# Altium project V5_BASE.PrjPcb
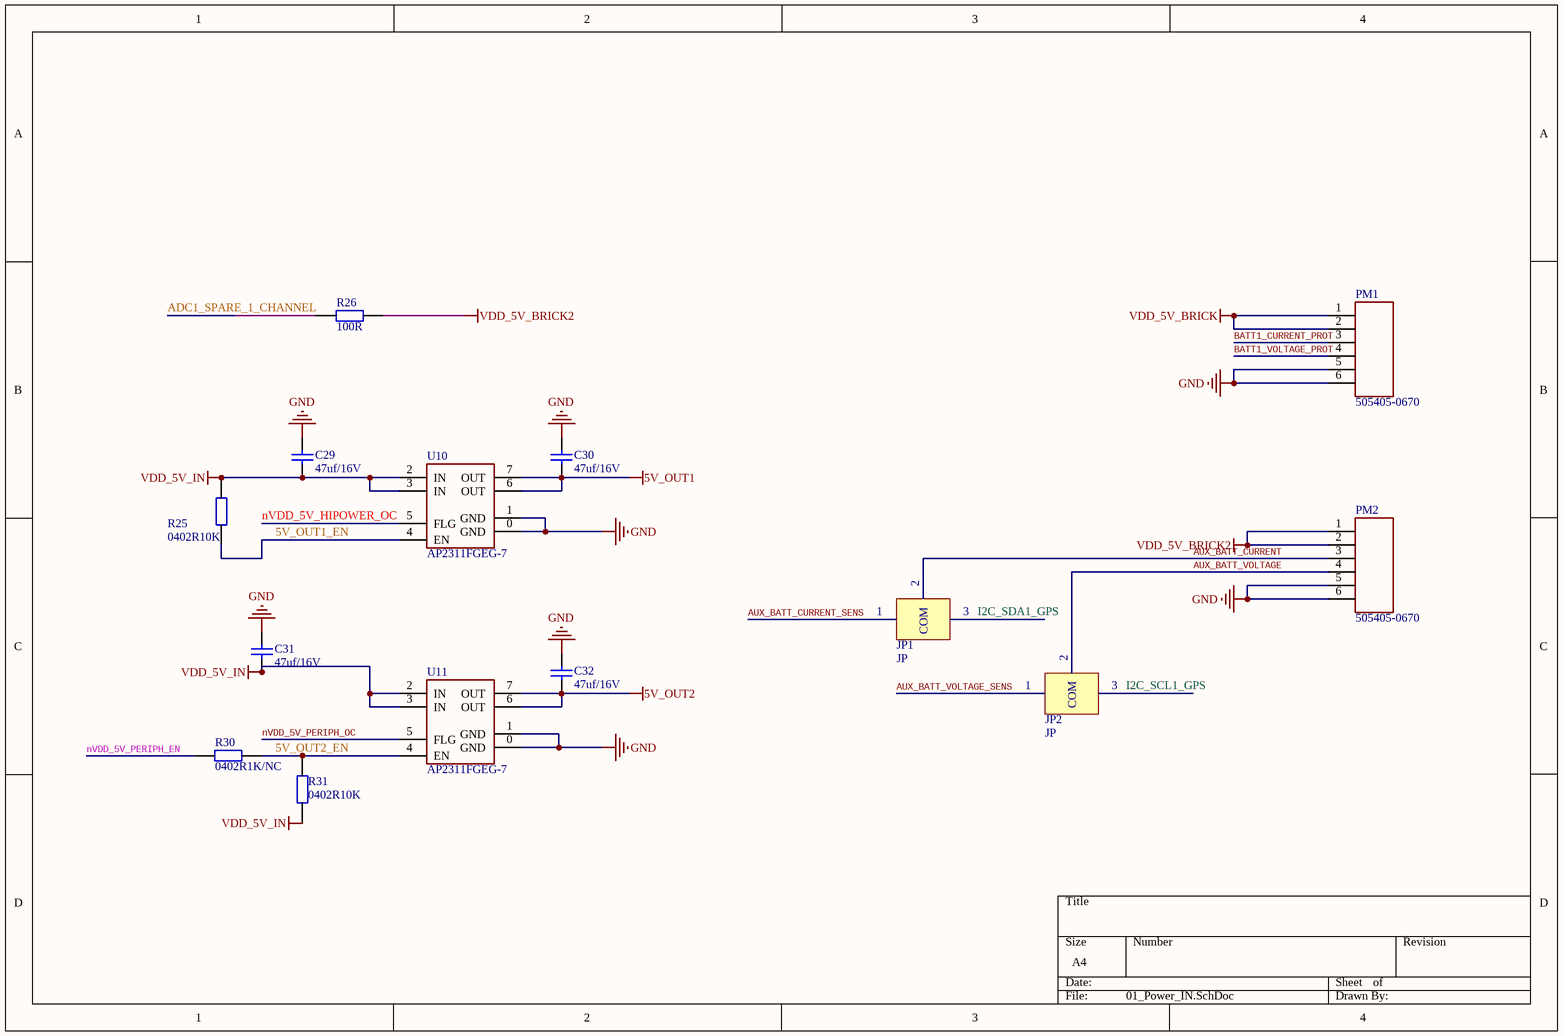
[diagram p0: 01_Power_IN.SchDoc]
5 sheets, 98 parts. Net scope: global (net labels, ports and power ports of the same name join across sheets).
Board file: V5_BASE_V17.PcbDoc
Sheets:
  01_Power_IN.SchDoc
  02_B_TO_B_CON.SchDoc
  03_Power_Switch.SchDoc
  04_POWER_LDO.SchDoc
  05_DATA_IO.SchDoc

## Sheet 01_Power_IN.SchDoc
size A4

### Parts
C29  47uf/16V  [0805CAP]
C30  47uf/16V  [0805CAP]
C31  47uf/16V  [0805CAP]
C32  47uf/16V  [0805CAP]
JP1  JP  [0402R-SR]
JP2  JP  [0402R-SR]
PM1  505405-0670  [5054050660]
PM2  505405-0670  [5054050660]
R25  0402R10K  [0402R]
R26  100R  [0402R]
R30  0402R1K/NC  [0402R]
R31  0402R10K  [0402R]
U10  AP2311FGEG-7  [QFN8_0.65]
U11  AP2311FGEG-7  [QFN8_0.65]

### Nets
5V_OUT1: C30.1 U10.6(OUT) U10.7(OUT)
5V_OUT2: C32.1 U11.6(OUT) U11.7(OUT)
GND: C29.2 C30.2 C31.2 C32.2 PM1.5 PM1.6 PM2.5 PM2.6 U10.0(GND) U10.1(GND) U11.0(GND) U11.1(GND)
VDD_5V_BRICK: PM1.1 PM1.2
VDD_5V_BRICK2: PM2.1 PM2.2 R26.2
VDD_5V_IN: C29.1 C31.1 R25.2 R31.2 U10.2(IN) U10.3(IN) U11.2(IN) U11.3(IN)
5V_OUT1_EN: R25.1 U10.4(EN)
5V_OUT2_EN: R30.1 R31.1 U11.4(EN)
ADC1_SPARE_1_CHANNEL: R26.1
AUX_BATT_CURRENT: JP1.2(COM) PM2.3
AUX_BATT_CURRENT_SENS: JP1.1
AUX_BATT_VOLTAGE: JP2.2(COM) PM2.4
AUX_BATT_VOLTAGE_SENS: JP2.1
BATT1_CURRENT_PROT: PM1.3
BATT1_VOLTAGE_PROT: PM1.4
I2C_SCL1_GPS: JP2.3
I2C_SDA1_GPS: JP1.3
nVDD_5V_HIPOWER_OC: U10.5(FLG)
nVDD_5V_PERIPH_EN: R30.2
nVDD_5V_PERIPH_OC: U11.5(FLG)

### Library data of the parts
C29-C32 = Cap: Capacitor
JP1 JP2 = 0402R-SR
PM1 PM2 = 5054050660
R25 R26 R30 R31 = 0402R1K: 0402R1K 1%

## Sheet 02_B_TO_B_CON.SchDoc
size A3
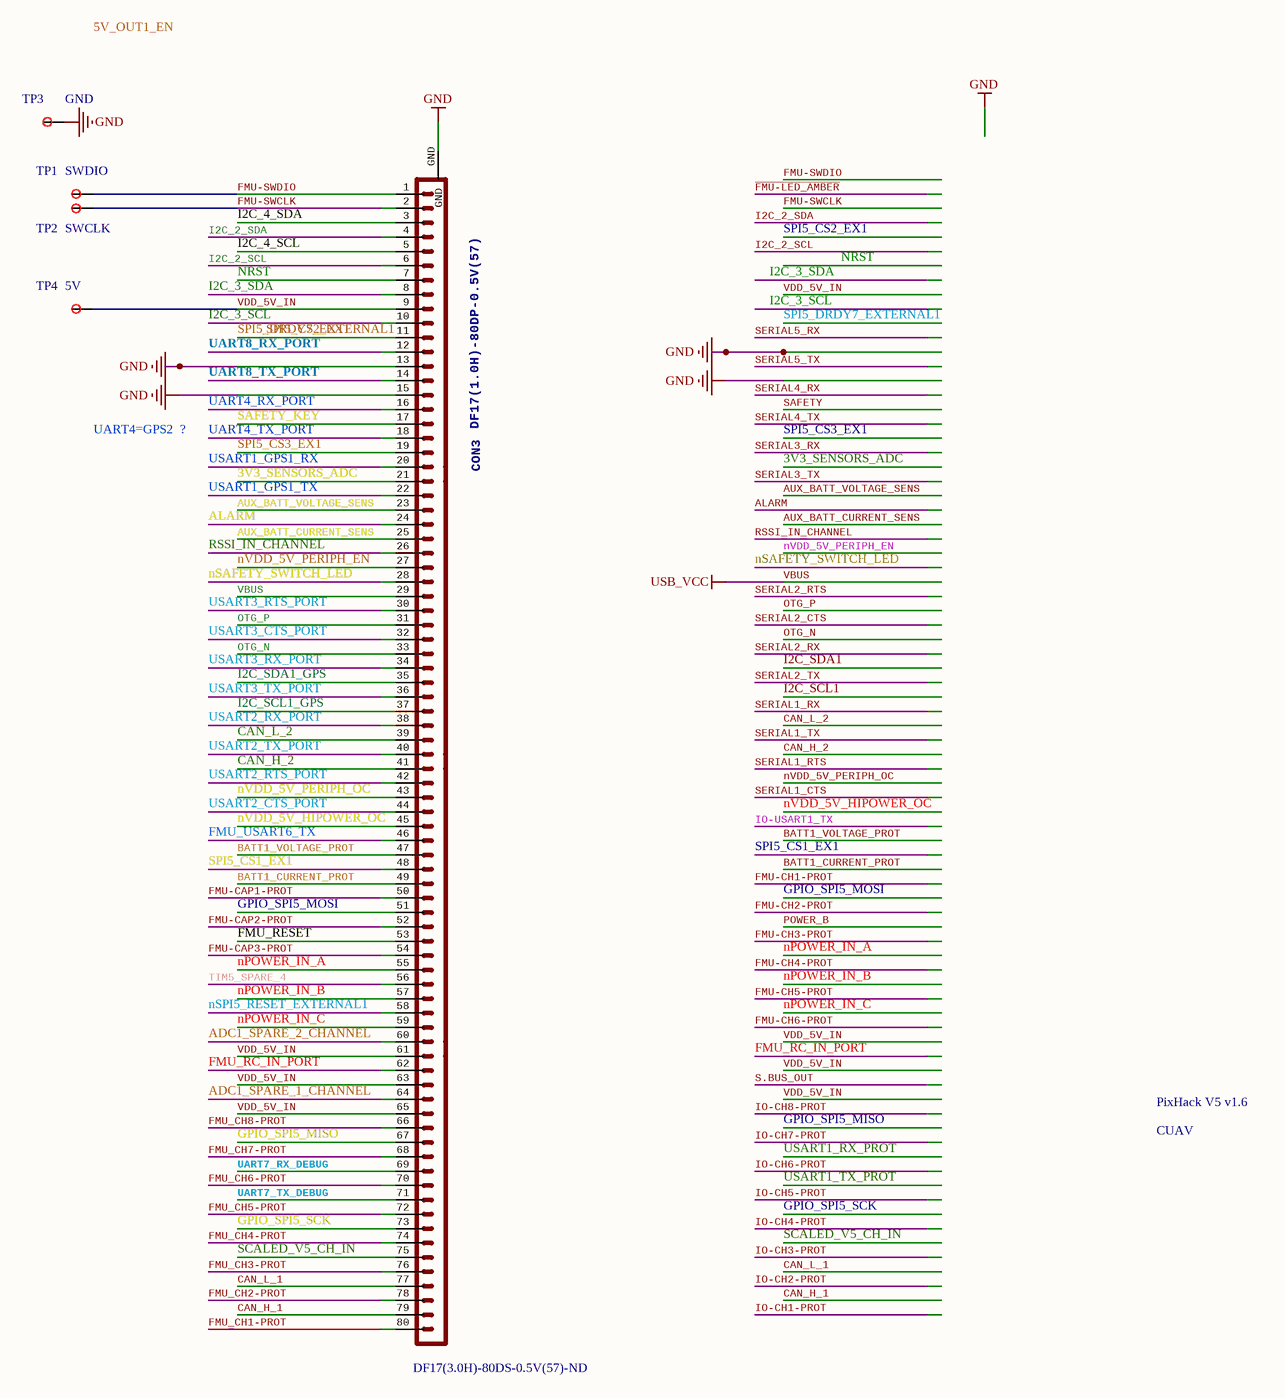
[diagram p1: 02_B_TO_B_CON.SchDoc]

### Parts
CON3  DF17(1.0H)-80DP-0.5V(57)  Supplier Part Number 1: DF17(3.0H)-80DS-0.5V(57)-ND  [DF17(1.0H)-80DP-0.5V(57)]
PixHack_V5_v1.6  CUAV  [CUAV]
TP1  SWDIO  [TP0.75]
TP2  SWCLK  [TP0.75]
TP3  GND  [TP0.75]
TP4  5V  [TP0.75]

### Nets
GND: CON3.13 CON3.15 CON3.GND TP3.0
VBUS: CON3.29  [also labelled USB_VCC]
VDD_5V_IN: CON3.9 CON3.61 CON3.63 CON3.65 TP4.0
3V3_SENSORS_ADC: CON3.21
ADC1_SPARE_1_CHANNEL: CON3.64
ADC1_SPARE_2_CHANNEL: CON3.60
ALARM: CON3.24
AUX_BATT_CURRENT_SENS: CON3.25
AUX_BATT_VOLTAGE_SENS: CON3.23
BATT1_CURRENT_PROT: CON3.49
BATT1_VOLTAGE_PROT: CON3.47
CAN_H_1: CON3.79
CAN_H_2: CON3.41
CAN_L_1: CON3.77
CAN_L_2: CON3.39
FMU-CAP1-PROT: CON3.50
FMU-CAP2-PROT: CON3.52
FMU-CAP3-PROT: CON3.54
FMU-SWCLK: CON3.2 TP2.0
FMU-SWDIO: CON3.1 TP1.0
FMU_CH1-PROT: CON3.80
FMU_CH2-PROT: CON3.78
FMU_CH3-PROT: CON3.76
FMU_CH4-PROT: CON3.74
FMU_CH5-PROT: CON3.72
FMU_CH6-PROT: CON3.70
FMU_CH7-PROT: CON3.68
FMU_CH8-PROT: CON3.66
FMU_RC_IN_PORT: CON3.62
FMU_RESET: CON3.53
FMU_USART6_TX: CON3.46
GPIO_SPI5_MISO: CON3.67
GPIO_SPI5_MOSI: CON3.51
GPIO_SPI5_SCK: CON3.73
I2C_2_SCL: CON3.6
I2C_2_SDA: CON3.4
I2C_3_SCL: CON3.10
I2C_3_SDA: CON3.8
I2C_4_SCL: CON3.5
I2C_4_SDA: CON3.3
I2C_SCL1_GPS: CON3.37
I2C_SDA1_GPS: CON3.35
nPOWER_IN_A: CON3.55
nPOWER_IN_B: CON3.57
nPOWER_IN_C: CON3.59
NRST: CON3.7
nSAFETY_SWITCH_LED: CON3.28
nSPI5_RESET_EXTERNAL1: CON3.58
nVDD_5V_HIPOWER_OC: CON3.45
nVDD_5V_PERIPH_EN: CON3.27
nVDD_5V_PERIPH_OC: CON3.43
OTG_N: CON3.33
OTG_P: CON3.31
RSSI_IN_CHANNEL: CON3.26
SAFETY_KEY: CON3.17
SCALED_V5_CH_IN: CON3.75
SPI5_CS1_EX1: CON3.48
SPI5_CS2_EX1: CON3.11  [also labelled SPI5_DRDY7_EXTERNAL1]
SPI5_CS3_EX1: CON3.19
TIM5_SPARE_4: CON3.56
UART4_RX_PORT: CON3.16
UART4_TX_PORT: CON3.18
UART7_RX_DEBUG: CON3.69
UART7_TX_DEBUG: CON3.71
UART8_RX_PORT: CON3.12
UART8_TX_PORT: CON3.14
USART1_GPS1_RX: CON3.20
USART1_GPS1_TX: CON3.22
USART2_CTS_PORT: CON3.44
USART2_RTS_PORT: CON3.42
USART2_RX_PORT: CON3.38
USART2_TX_PORT: CON3.40
USART3_CTS_PORT: CON3.32
USART3_RTS_PORT: CON3.30
USART3_RX_PORT: CON3.34
USART3_TX_PORT: CON3.36

### Notes on the sheet
- Labels drawn without touching a wire or pin: 5V_OUT1_EN, UART4=GPS2  ?

### Library data of the parts
CON3 = CON-DF17-80F: CONN RECEPT 80POS .5MM SMD W/FIT; 3DR_PARTNO: ECM0518; PARTNO: DF17(3.0H)-80DS-0.5V(57); Supplier 1: Digi-Key
TP1-TP4 = TP_0.75: TP_0.75MM

## Sheet 03_Power_Switch.SchDoc
size A4
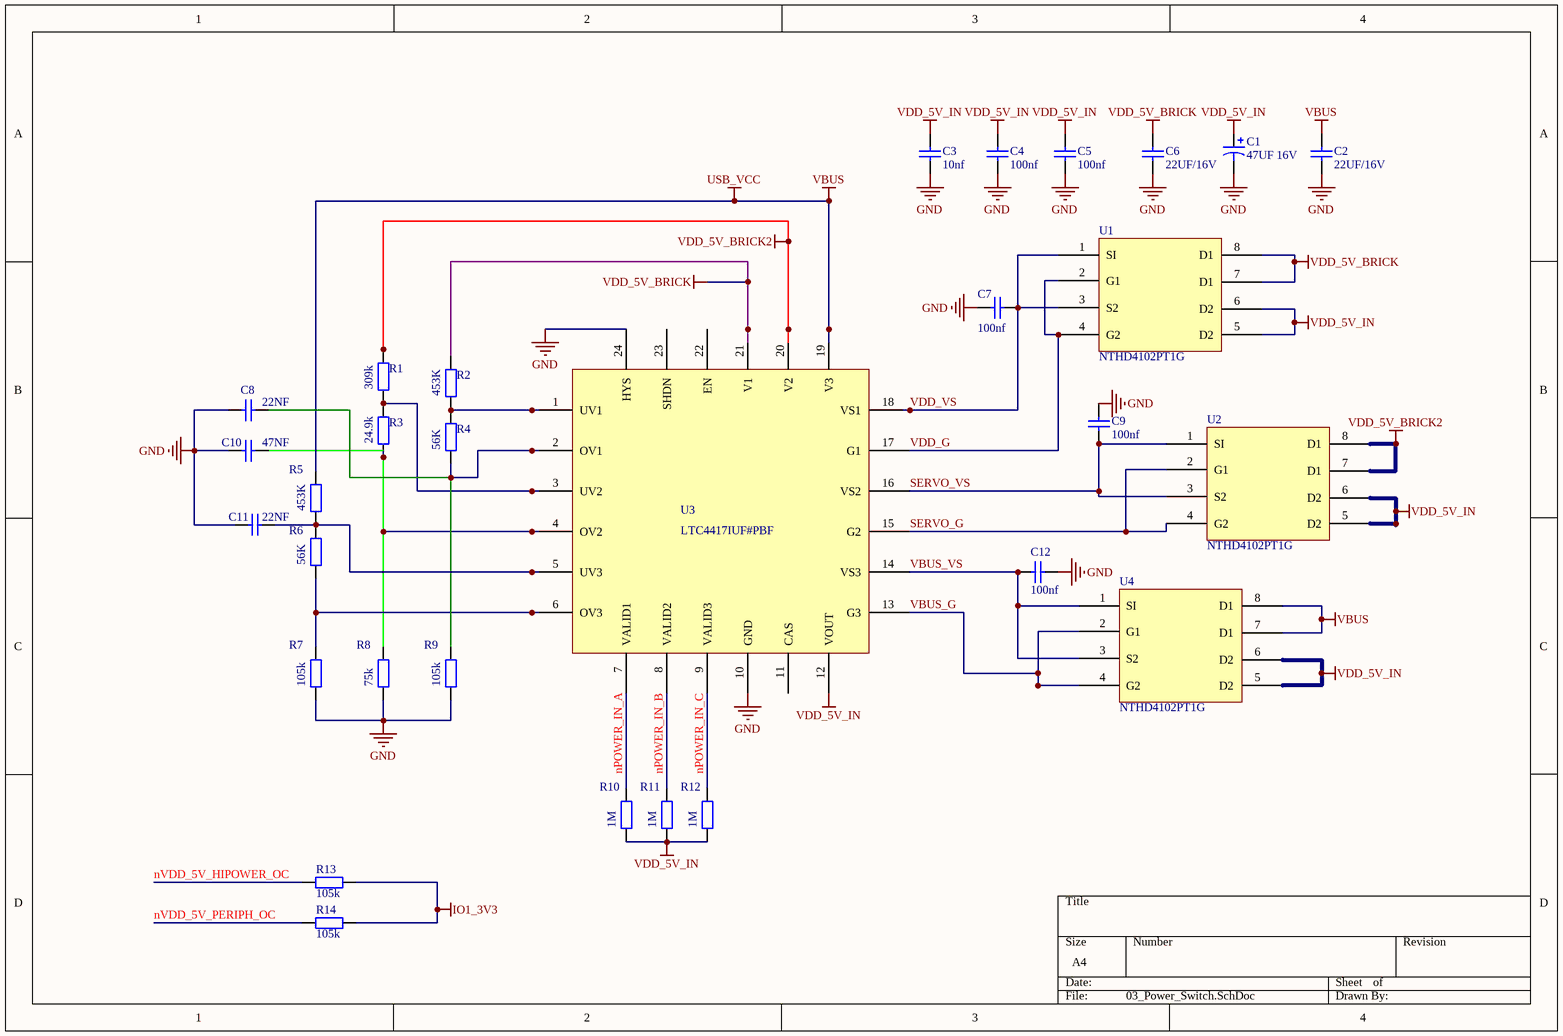
[diagram p2: 03_Power_Switch.SchDoc]

### Parts
C1  47UF 16V  [7343CAP]
C2  22UF/16V  [0805CAP]
C3  10nf  [0402CAP]
C4  100nf  [0402CAP]
C5  100nf  [0402CAP]
C6  22UF/16V  [0805CAP]
C7  100nf  [0402CAP]
C8  22NF  [0402CAP]
C9  100nf  [0402CAP]
C10  47NF  [0402CAP]
C11  22NF  [0402CAP]
C12  100nf  [0402CAP]
R1  309k  [R0402]
R2  453K  [R0402]
R3  24.9k  [R0402]
R4  56K  [R0402]
R5  453K  [R0402]
R6  56K  [R0402]
R7  105k  [R0402]
R8  75k  [R0402]
R9  105k  [R0402]
R10  1M  [R0402]
R11  1M  [R0402]
R12  1M  [R0402]
R13  105k  [R0402]
R14  105k  [R0402]
U1  NTHD4102PT1G  [1206-8]
U2  NTHD4102PT1G  [1206-8]
U3  LTC4417IUF#PBF  [QFN24]
U4  NTHD4102PT1G  [1206-8]

### Nets
GND: C1.C C2.1 C3.1 C4.1 C5.1 C6.1 C7.2 C8.2 C9.2 C10.2 C11.2 C12.2 R7.1 R8.1 R9.1 U3.10(GND) U3.24(HYS)
IO1_3V3: R13.2 R14.2
VBUS: C2.2 R5.2 U3.19(V3) U4.7(D1) U4.8(D1)  [also labelled USB_VCC]
VDD_5V_BRICK: C6.2 R2.2 U1.7(D1) U1.8(D1) U3.21(V1)
VDD_5V_BRICK2: R1.2 U2.7(D1) U2.8(D1) U3.20(V2)
VDD_5V_IN: C1.A C3.2 C4.2 C5.2 R10.1 R11.1 R12.1 U1.5(D2) U1.6(D2) U2.5(D2) U2.6(D2) U3.12(VOUT) U4.5(D2) U4.6(D2)
nPOWER_IN_A: R10.2 U3.7(VALID1)
nPOWER_IN_B: R11.2 U3.8(VALID2)
nPOWER_IN_C: R12.2 U3.9(VALID3)
nVDD_5V_HIPOWER_OC: R13.1
nVDD_5V_PERIPH_OC: R14.1
SERVO_G: U2.2(G1) U2.4(G2) U3.15(G2)
SERVO_VS: C9.1 U2.1(SI) U2.3(S2) U3.16(VS2)
VBUS_G: U3.13(G3) U4.2(G1) U4.4(G2)
VBUS_VS: C12.1 U3.14(VS3) U4.1(SI) U4.3(S2)
VDD_G: U1.2(G1) U1.4(G2) U3.17(G1)
VDD_VS: C7.1 U1.1(SI) U1.3(S2) U3.18(VS1)
NetC8_1: C8.1 R4.1 R9.2 U3.2(OV1)
NetC10_1: C10.1 R3.1 R8.2 U3.4(OV2)
NetC11_1: C11.1 R5.1 R6.2 U3.5(UV3)
NetR1_1: R1.1 R3.2 U3.3(UV2)
NetR2_1: R2.1 R4.2 U3.1(UV1)
NetR6_1: R6.1 R7.2 U3.6(OV3)

Not connected (* = marked no-connect by the designer): U3 11(CAS) 22(EN) 23(SHDN)

### Library data of the parts
C1 = Cap Pol1: Polarized Capacitor (Radial); Value: 100pF; Published: 8-Jun-2000; LatestRevisionDate: 17-Jul-2002; LatestRevisionNote: Re-released for DXP Platform.; PackageReference: RB7.6-15; Publisher: Altium Limited; PackageDescription: Polarized Capacitor (Radial); 2 Leads
C2-C12 = Cap: Value: 100pF; Published: 8-Jun-2000; LatestRevisionDate: 17-Jul-2002; LatestRevisionNote: Re-released for DXP Platform.; PackageReference: RAD-0.3; Publisher: Altium Limited; PackageDescription: Radial Cap, Thru-Hole; 2 Leads; 0.3 in Pin Spacing
R1-R14 = Res2: Resistor; Value: 1K; Published: 8-Jun-2000; LatestRevisionDate: 17-Jul-2002; LatestRevisionNote: Re-released for DXP Platform.; PackageReference: AXIAL-0.4; Publisher: Altium Limited; PackageDescription: Axial Device, Thru-Hole; 2 Leads; 0.4 in Pin Spacing

## Sheet 04_POWER_LDO.SchDoc
size A4
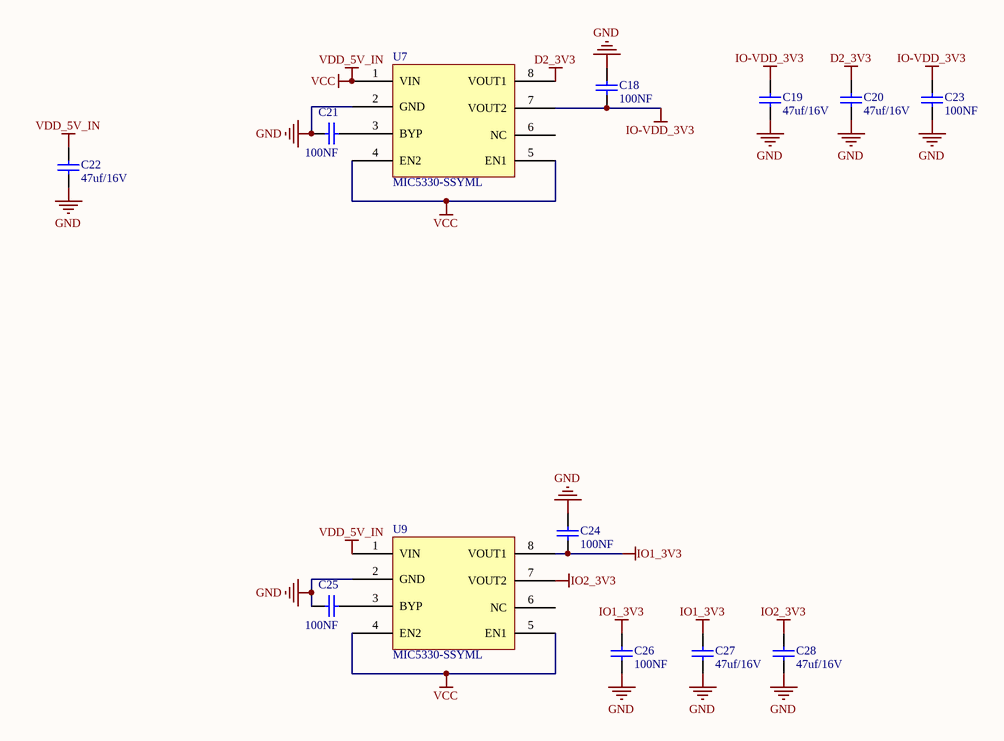
[diagram p3: 04_POWER_LDO.SchDoc]

### Parts
C18  100NF  [0402CAP]
C19  47uf/16V  [0805CAP]
C20  47uf/16V  [0805CAP]
C21  100NF  [0402CAP]
C22  47uf/16V  [0805CAP]
C23  100NF  [0402CAP]
C24  100NF  [0402CAP]
C25  100NF  [0402CAP]
C26  100NF  [0402CAP]
C27  47uf/16V  [0805CAP]
C28  47uf/16V  [0805CAP]
U7  MIC5330-SSYML  [MIC5530]
U9  MIC5330-SSYML  [MIC5530]

### Nets
D2_3V3: C20.1 U7.8(VOUT1)
GND: C18.2 C19.2 C20.2 C21.2 C22.2 C23.1 C24.2 C25.2 C26.1 C27.2 C28.2 U7.2(GND) U9.2(GND)
IO1_3V3: C24.1 C26.2 C27.1 U9.8(VOUT1)
IO2_3V3: C28.1 U9.7(VOUT2)
IO-VDD_3V3: C18.1 C19.1 C23.2 U7.7(VOUT2)
VDD_5V_IN: C22.1 U7.1(VIN) U7.4(EN2) U7.5(EN1) U9.1(VIN) U9.4(EN2) U9.5(EN1)  [also labelled VCC]
NetC21_1: C21.1 U7.3(BYP)
NetC25_1: C25.1 U9.3(BYP)

Not connected (* = marked no-connect by the designer): U7 6(NC); U9 6(NC)

### Library data of the parts
C18 C21 C24 C25 = Cap: Value: 100pF; Published: 8-Jun-2000; LatestRevisionDate: 17-Jul-2002; LatestRevisionNote: Re-released for DXP Platform.; PackageReference: RAD-0.3; Publisher: Altium Limited; PackageDescription: Radial Cap, Thru-Hole; 2 Leads; 0.3 in Pin Spacing
C19 C20 C22 C27 C28 = Cap: Capacitor
C23 C26 = Cap
U7 U9 = MIC5530

## Sheet 05_DATA_IO.SchDoc
size A3
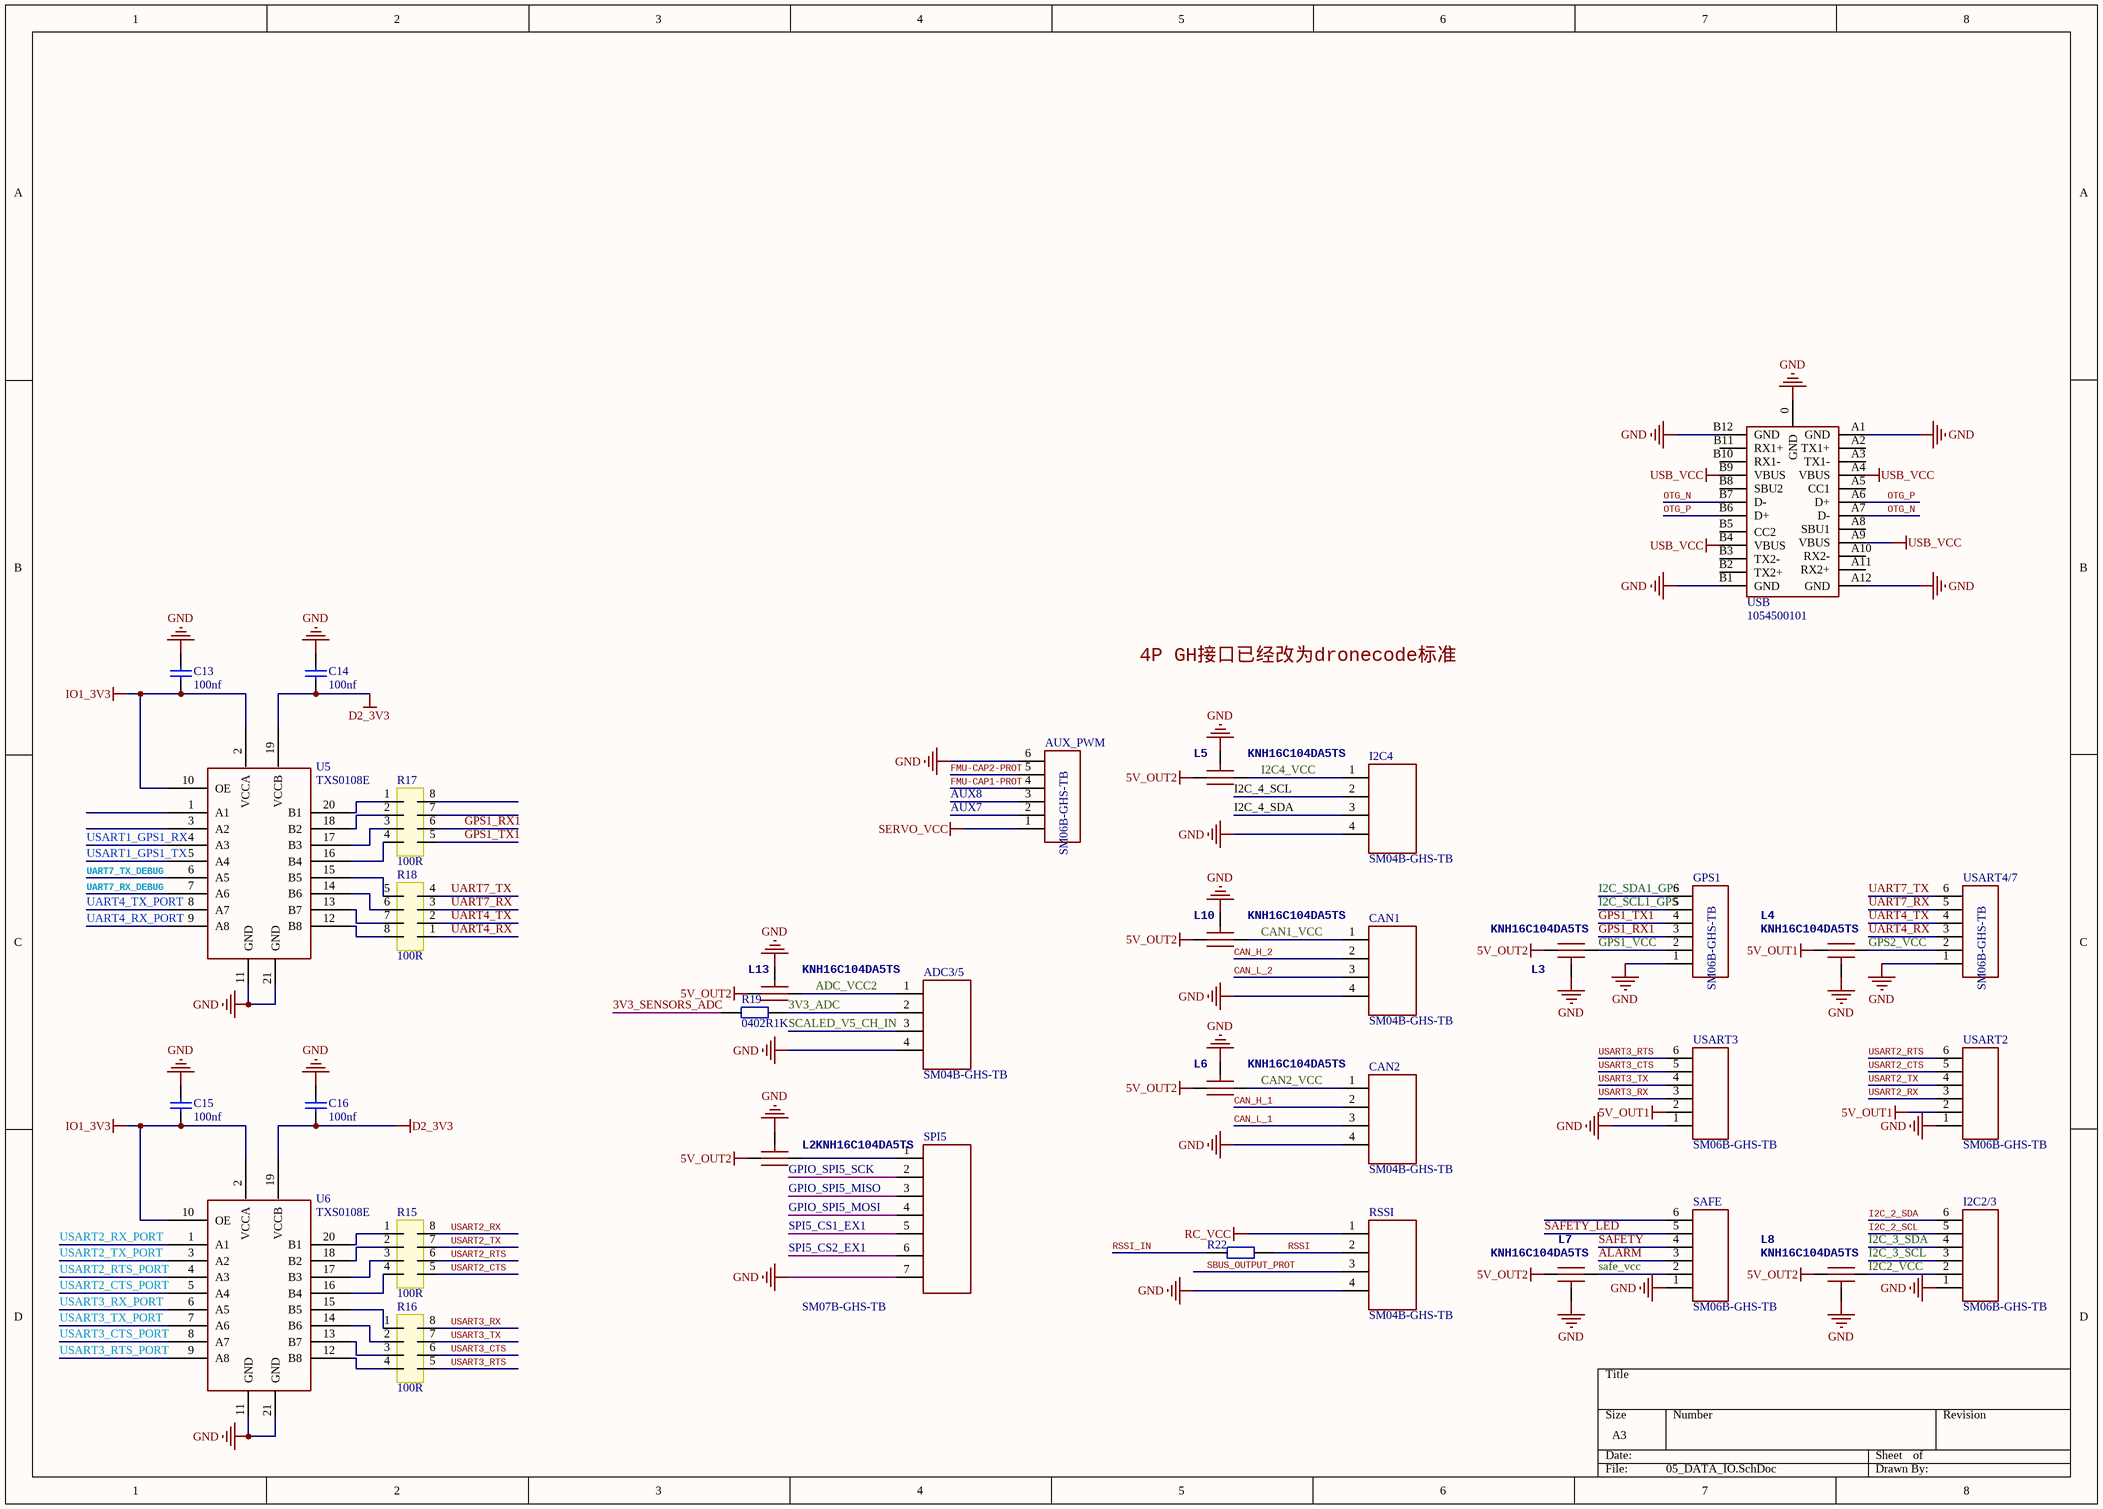
[diagram p4: 05_DATA_IO.SchDoc]

### Parts
ADC3/5  SM04B-GHS-TB  [BM04B-GHS_DC]
AUX_PWM  SM06B-GHS-TB  [BM06B-GHS_DC]
C13  100nf  [0402CAP]
C14  100nf  [0402CAP]
C15  100nf  [0402CAP]
C16  100nf  [0402CAP]
CAN1  SM04B-GHS-TB  [BM04B-GHS_DC]
CAN2  SM04B-GHS-TB  [BM04B-GHS_DC]
GPS1  SM06B-GHS-TB  [SM06B-GHS-TB]
I2C2/3  SM06B-GHS-TB  [SM06B-GHS-TB]
I2C4  SM04B-GHS-TB  [BM04B-GHS_DC]
L2  KNH16C104DA5TS  [KYOCERA-KNH16-DA]
L3  KNH16C104DA5TS  [KYOCERA-KNH16-DA]
L4  KNH16C104DA5TS  [KYOCERA-KNH16-DA]
L5  KNH16C104DA5TS  [KYOCERA-KNH16-DA]
L6  KNH16C104DA5TS  [KYOCERA-KNH16-DA]
L7  KNH16C104DA5TS  [KYOCERA-KNH16-DA]
L8  KNH16C104DA5TS  [KYOCERA-KNH16-DA]
L10  KNH16C104DA5TS  [KYOCERA-KNH16-DA]
L13  KNH16C104DA5TS  [KYOCERA-KNH16-DA]
R15  100R  [0402_4r]
R16  100R  [0402_4r]
R17  100R  [0402_4r]
R18  100R  [0402_4r]
R19  0402R1K  [0402R]
R22  0402R100R  [0402R]  (value not drawn)
RSSI  SM04B-GHS-TB  [BM04B-GHS_DC]
SAFE  SM06B-GHS-TB  [SM06B-GHS-TB]
SPI5  SM07B-GHS-TB  [SM07B-GHS]
U5  TXS0108E  [VQFN20]
U6  TXS0108E  [VQFN20]
USART2  SM06B-GHS-TB  [SM06B-GHS-TB]
USART3  SM06B-GHS-TB  [SM06B-GHS-TB]
USART4/7  SM06B-GHS-TB  [SM06B-GHS-TB]
USB  1054500101  [1054500101]

### Nets
5V_OUT1: L4.P$1 USART2.2 USART3.2
5V_OUT2: L2.P$2 L3.P$1 L5.P$2 L6.P$2 L7.P$1 L8.P$1 L10.P$2 L13.P$2
D2_3V3: C14.2 C16.2 U5.19(VCCB) U6.19(VCCB)
GND: ADC3/5.4 AUX_PWM.6 C13.1 C14.1 C15.1 C16.1 CAN1.4 CAN2.4 GPS1.1 I2C2/3.1 I2C4.4 L2.GND L3.GND L4.GND L5.GND L6.GND L7.GND L8.GND L10.GND L13.GND RSSI.4 SAFE.1 SPI5.7 U5.11(GND) U5.21(GND) U6.11(GND) U6.21(GND) USART2.1 USART3.1 USART4/7.1 USB.0(GND) USB.A1(GND) USB.A12(GND) USB.B1(GND) USB.B12(GND)
IO1_3V3: C13.2 C15.2 U5.2(VCCA) U5.10(OE) U6.2(VCCA) U6.10(OE)
RC_VCC: RSSI.1
SERVO_VCC: AUX_PWM.1
USB_VCC: USB.A4(VBUS) USB.A9(VBUS) USB.B4(VBUS) USB.B9(VBUS)  [project net VBUS]
3V3_ADC: ADC3/5.2 R19.2
3V3_SENSORS_ADC: R19.1
ADC_VCC2: ADC3/5.1 L13.P$1
ALARM: SAFE.3
AUX7: AUX_PWM.2
AUX8: AUX_PWM.3
CAN1_VCC: CAN1.1 L10.P$1
CAN2_VCC: CAN2.1 L6.P$1
CAN_H_1: CAN2.2
CAN_H_2: CAN1.2
CAN_L_1: CAN2.3
CAN_L_2: CAN1.3
FMU-CAP1-PROT: AUX_PWM.4
FMU-CAP2-PROT: AUX_PWM.5
GPIO_SPI5_MISO: SPI5.3
GPIO_SPI5_MOSI: SPI5.4
GPIO_SPI5_SCK: SPI5.2
GPS1_RX1: GPS1.3 R17.6
GPS1_TX1: GPS1.4 R17.5
GPS1_VCC: GPS1.2 L3.P$2
GPS2_VCC: L4.P$2 USART4/7.2
I2C2_VCC: I2C2/3.2 L8.P$2
I2C4_VCC: I2C4.1 L5.P$1
I2C_2_SCL: I2C2/3.5
I2C_2_SDA: I2C2/3.6
I2C_3_SCL: I2C2/3.3
I2C_3_SDA: I2C2/3.4
I2C_4_SCL: I2C4.2
I2C_4_SDA: I2C4.3
I2C_SCL1_GPS: GPS1.5
I2C_SDA1_GPS: GPS1.6
OTG_N: USB.A7(D-) USB.B7(D-)
OTG_P: USB.A6(D+) USB.B6(D+)
RSSI: R22.2 RSSI.2
RSSI_IN: R22.1
safe_vcc: L7.P$2 SAFE.2
SAFETY: SAFE.4
SAFETY_LED: SAFE.5
SBUS_OUTPUT_PROT: RSSI.3
SCALED_V5_CH_IN: ADC3/5.3
SPI5_CS1_EX1: SPI5.5
SPI5_CS2_EX1: SPI5.6
UART4_RX: R18.1 USART4/7.3
UART4_RX_PORT: U5.9(A8)
UART4_TX: R18.2 USART4/7.4
UART4_TX_PORT: U5.8(A7)
UART7_RX: R18.3 USART4/7.5
UART7_RX_DEBUG: U5.7(A6)
UART7_TX: R18.4 USART4/7.6
UART7_TX_DEBUG: U5.6(A5)
USART1_GPS1_RX: U5.4(A3)
USART1_GPS1_TX: U5.5(A4)
USART2_CTS: R15.5 USART2.5
USART2_CTS_PORT: U6.5(A4)
USART2_RTS: R15.6 USART2.6
USART2_RTS_PORT: U6.4(A3)
USART2_RX: R15.8 USART2.3
USART2_RX_PORT: U6.1(A1)
USART2_TX: R15.7 USART2.4
USART2_TX_PORT: U6.3(A2)
USART3_CTS: R16.6 USART3.5
USART3_CTS_PORT: U6.8(A7)
USART3_RTS: R16.5 USART3.6
USART3_RTS_PORT: U6.9(A8)
USART3_RX: R16.8 USART3.3
USART3_RX_PORT: U6.6(A5)
USART3_TX: R16.7 USART3.4
USART3_TX_PORT: U6.7(A6)
NetL2_P$1: L2.P$1 SPI5.1
NetR15_1: R15.1 U6.20(B1)
NetR15_2: R15.2 U6.18(B2)
NetR15_3: R15.3 U6.17(B3)
NetR15_4: R15.4 U6.16(B4)
NetR16_1: R16.1 U6.15(B5)
NetR16_2: R16.2 U6.14(B6)
NetR16_3: R16.3 U6.13(B7)
NetR16_4: R16.4 U6.12(B8)
NetR17_1: R17.1 U5.20(B1)
NetR17_2: R17.2 U5.18(B2)
NetR17_3: R17.3 U5.17(B3)
NetR17_4: R17.4 U5.16(B4)
NetR18_5: R18.5 U5.15(B5)
NetR18_6: R18.6 U5.14(B6)
NetR18_7: R18.7 U5.13(B7)
NetR18_8: R18.8 U5.12(B8)

Not connected (* = marked no-connect by the designer): R17 7 8; SAFE 6; U5 1(A1) 3(A2); USB A2(TX1+) A3(TX1-) A5(CC1) A8(SBU1) A10(RX2-) A11(RX2+) B2(TX2+) B3(TX2-) B5(CC2) B8(SBU2) B10(RX1-) B11(RX1+)

### Notes on the sheet
- Labels drawn without touching a wire or pin: 4P GH接口已经改为dronecode标准

### Library data of the parts
AUX_PWM = SM06B-GHS-TB: dronecode
C13-C16 = Cap
CAN1 CAN2 I2C4 RSSI = SM04B-GHS-TB: dronecode
L2-L8 L10 L13 = KNH16C104DA5TS: Capacitor, Filter, 0.1uF, 25V, 2A, 0603, SMD; 3DR_PARTNO: ECM0719; Supplier 1: Digi-Key
R15-R18 = 0402-8R-4R
R19 = 0402R1K: 0402R1K 1%
R22 = 0402R100R: 0402R100R 1%

## Nets that join several sheets
5V_OUT1: 01_Power_IN (C30.1 U10.6 U10.7), 05_DATA_IO (L4.P$1 USART2.2 USART3.2)
5V_OUT2: 01_Power_IN (C32.1 U11.6 U11.7), 05_DATA_IO (8 pins)
D2_3V3: 04_POWER_LDO (C20.1 U7.8), 05_DATA_IO (C14.2 C16.2 U5.19 U6.19)
GND: 01_Power_IN (12 pins), 02_B_TO_B_CON (CON3.13 CON3.15 CON3.GND TP3.0), 03_Power_Switch (17 pins), 04_POWER_LDO (13 pins), 05_DATA_IO (35 pins)
IO1_3V3: 03_Power_Switch (R13.2 R14.2), 04_POWER_LDO (C24.1 C26.2 C27.1 U9.8), 05_DATA_IO (6 pins)
VBUS: 02_B_TO_B_CON (CON3.29), 03_Power_Switch (5 pins), 05_DATA_IO (USB.A4 USB.A9 USB.B4 USB.B9)
VDD_5V_BRICK: 01_Power_IN (PM1.1 PM1.2), 03_Power_Switch (5 pins)
VDD_5V_BRICK2: 01_Power_IN (PM2.1 PM2.2 R26.2), 03_Power_Switch (R1.2 U2.7 U2.8 U3.20)
VDD_5V_IN: 01_Power_IN (8 pins), 02_B_TO_B_CON (5 pins), 03_Power_Switch (14 pins), 04_POWER_LDO (7 pins)
3V3_SENSORS_ADC: 02_B_TO_B_CON (CON3.21), 05_DATA_IO (R19.1)
ADC1_SPARE_1_CHANNEL: 01_Power_IN (R26.1), 02_B_TO_B_CON (CON3.64)
ALARM: 02_B_TO_B_CON (CON3.24), 05_DATA_IO (SAFE.3)
AUX_BATT_CURRENT_SENS: 01_Power_IN (JP1.1), 02_B_TO_B_CON (CON3.25)
AUX_BATT_VOLTAGE_SENS: 01_Power_IN (JP2.1), 02_B_TO_B_CON (CON3.23)
BATT1_CURRENT_PROT: 01_Power_IN (PM1.3), 02_B_TO_B_CON (CON3.49)
BATT1_VOLTAGE_PROT: 01_Power_IN (PM1.4), 02_B_TO_B_CON (CON3.47)
CAN_H_1: 02_B_TO_B_CON (CON3.79), 05_DATA_IO (CAN2.2)
CAN_H_2: 02_B_TO_B_CON (CON3.41), 05_DATA_IO (CAN1.2)
CAN_L_1: 02_B_TO_B_CON (CON3.77), 05_DATA_IO (CAN2.3)
CAN_L_2: 02_B_TO_B_CON (CON3.39), 05_DATA_IO (CAN1.3)
FMU-CAP1-PROT: 02_B_TO_B_CON (CON3.50), 05_DATA_IO (AUX_PWM.4)
FMU-CAP2-PROT: 02_B_TO_B_CON (CON3.52), 05_DATA_IO (AUX_PWM.5)
GPIO_SPI5_MISO: 02_B_TO_B_CON (CON3.67), 05_DATA_IO (SPI5.3)
GPIO_SPI5_MOSI: 02_B_TO_B_CON (CON3.51), 05_DATA_IO (SPI5.4)
GPIO_SPI5_SCK: 02_B_TO_B_CON (CON3.73), 05_DATA_IO (SPI5.2)
I2C_2_SCL: 02_B_TO_B_CON (CON3.6), 05_DATA_IO (I2C2/3.5)
I2C_2_SDA: 02_B_TO_B_CON (CON3.4), 05_DATA_IO (I2C2/3.6)
I2C_3_SCL: 02_B_TO_B_CON (CON3.10), 05_DATA_IO (I2C2/3.3)
I2C_3_SDA: 02_B_TO_B_CON (CON3.8), 05_DATA_IO (I2C2/3.4)
I2C_4_SCL: 02_B_TO_B_CON (CON3.5), 05_DATA_IO (I2C4.2)
I2C_4_SDA: 02_B_TO_B_CON (CON3.3), 05_DATA_IO (I2C4.3)
I2C_SCL1_GPS: 01_Power_IN (JP2.3), 02_B_TO_B_CON (CON3.37), 05_DATA_IO (GPS1.5)
I2C_SDA1_GPS: 01_Power_IN (JP1.3), 02_B_TO_B_CON (CON3.35), 05_DATA_IO (GPS1.6)
nPOWER_IN_A: 02_B_TO_B_CON (CON3.55), 03_Power_Switch (R10.2 U3.7)
nPOWER_IN_B: 02_B_TO_B_CON (CON3.57), 03_Power_Switch (R11.2 U3.8)
nPOWER_IN_C: 02_B_TO_B_CON (CON3.59), 03_Power_Switch (R12.2 U3.9)
nVDD_5V_HIPOWER_OC: 01_Power_IN (U10.5), 02_B_TO_B_CON (CON3.45), 03_Power_Switch (R13.1)
nVDD_5V_PERIPH_EN: 01_Power_IN (R30.2), 02_B_TO_B_CON (CON3.27)
nVDD_5V_PERIPH_OC: 01_Power_IN (U11.5), 02_B_TO_B_CON (CON3.43), 03_Power_Switch (R14.1)
OTG_N: 02_B_TO_B_CON (CON3.33), 05_DATA_IO (USB.A7 USB.B7)
OTG_P: 02_B_TO_B_CON (CON3.31), 05_DATA_IO (USB.A6 USB.B6)
SCALED_V5_CH_IN: 02_B_TO_B_CON (CON3.75), 05_DATA_IO (ADC3/5.3)
SPI5_CS1_EX1: 02_B_TO_B_CON (CON3.48), 05_DATA_IO (SPI5.5)
SPI5_CS2_EX1: 02_B_TO_B_CON (CON3.11), 05_DATA_IO (SPI5.6)
UART4_RX_PORT: 02_B_TO_B_CON (CON3.16), 05_DATA_IO (U5.9)
UART4_TX_PORT: 02_B_TO_B_CON (CON3.18), 05_DATA_IO (U5.8)
UART7_RX_DEBUG: 02_B_TO_B_CON (CON3.69), 05_DATA_IO (U5.7)
UART7_TX_DEBUG: 02_B_TO_B_CON (CON3.71), 05_DATA_IO (U5.6)
USART1_GPS1_RX: 02_B_TO_B_CON (CON3.20), 05_DATA_IO (U5.4)
USART1_GPS1_TX: 02_B_TO_B_CON (CON3.22), 05_DATA_IO (U5.5)
USART2_CTS_PORT: 02_B_TO_B_CON (CON3.44), 05_DATA_IO (U6.5)
USART2_RTS_PORT: 02_B_TO_B_CON (CON3.42), 05_DATA_IO (U6.4)
USART2_RX_PORT: 02_B_TO_B_CON (CON3.38), 05_DATA_IO (U6.1)
USART2_TX_PORT: 02_B_TO_B_CON (CON3.40), 05_DATA_IO (U6.3)
USART3_CTS_PORT: 02_B_TO_B_CON (CON3.32), 05_DATA_IO (U6.8)
USART3_RTS_PORT: 02_B_TO_B_CON (CON3.30), 05_DATA_IO (U6.9)
USART3_RX_PORT: 02_B_TO_B_CON (CON3.34), 05_DATA_IO (U6.6)
USART3_TX_PORT: 02_B_TO_B_CON (CON3.36), 05_DATA_IO (U6.7)